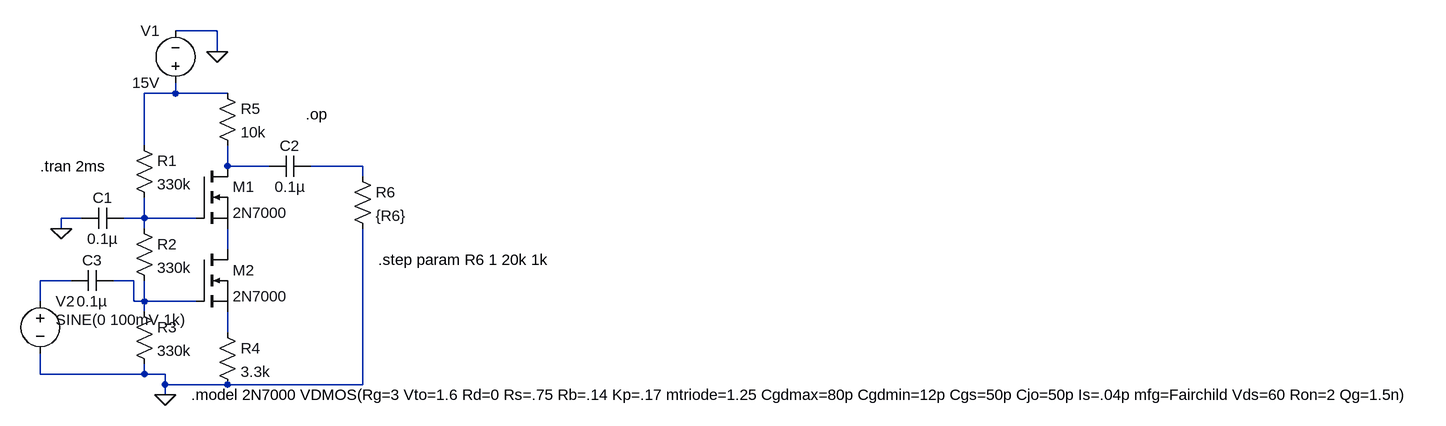
[diagram p0: schematic Draft2.asc]
Draft2.asc, the LTspice schematic file:
Version 4
SHEET 1 2268 680
WIRE 240 -208 176 -208
WIRE 240 -176 240 -208
WIRE 176 -112 176 -128
WIRE 176 -112 128 -112
WIRE 256 -112 176 -112
WIRE 128 -32 128 -112
WIRE 256 0 256 -32
WIRE 320 0 256 0
WIRE 464 0 384 0
WIRE 464 16 464 0
WIRE 32 80 0 80
WIRE 128 80 128 48
WIRE 128 80 96 80
WIRE 208 80 128 80
WIRE 0 96 0 80
WIRE 128 96 128 80
WIRE 256 128 256 96
WIRE 16 176 -32 176
WIRE 112 176 80 176
WIRE -32 208 -32 176
WIRE 112 208 112 176
WIRE 128 208 128 176
WIRE 128 208 112 208
WIRE 208 208 128 208
WIRE 128 224 128 208
WIRE 256 256 256 224
WIRE -32 320 -32 288
WIRE 128 320 128 304
WIRE 128 320 -32 320
WIRE 160 320 128 320
WIRE 160 336 160 320
WIRE 256 336 160 336
WIRE 464 336 464 96
WIRE 464 336 256 336
WIRE 160 352 160 336
FLAG 0 96 0
FLAG 240 -176 0
FLAG 160 352 0
SYMBOL cap 96 64 R90
WINDOW 0 0 32 VBottom 2
WINDOW 3 32 32 VTop 2
SYMATTR InstName C1
SYMATTR Value 0.1µ
SYMBOL res 112 -48 R0
SYMATTR InstName R1
SYMATTR Value 330k
SYMBOL res 112 80 R0
SYMATTR InstName R2
SYMATTR Value 330k
SYMBOL res 112 208 R0
SYMATTR InstName R3
SYMATTR Value 330k
SYMBOL nmos 208 0 R0
SYMATTR InstName M1
SYMATTR Value 2N7000
SYMBOL nmos 208 128 R0
SYMATTR InstName M2
SYMATTR Value 2N7000
SYMBOL res 240 240 R0
SYMATTR InstName R4
SYMATTR Value 3.3k
SYMBOL res 240 -128 R0
SYMATTR InstName R5
SYMATTR Value 10k
SYMBOL cap 384 -16 R90
WINDOW 0 0 32 VBottom 2
WINDOW 3 32 32 VTop 2
SYMATTR InstName C2
SYMATTR Value 0.1µ
SYMBOL cap 80 160 R90
WINDOW 0 0 32 VBottom 2
WINDOW 3 32 32 VTop 2
SYMATTR InstName C3
SYMATTR Value 0.1µ
SYMBOL voltage 176 -112 R180
WINDOW 0 24 96 Left 2
WINDOW 3 24 16 Left 2
WINDOW 123 0 0 Left 0
WINDOW 39 0 0 Left 0
SYMATTR InstName V1
SYMATTR Value 15V
SYMBOL voltage -32 192 R0
WINDOW 3 24 44 Left 2
WINDOW 123 0 0 Left 0
WINDOW 39 0 0 Left 0
SYMATTR InstName V2
SYMATTR Value SINE(0 100mV 1k)
SYMBOL res 448 0 R0
SYMATTR InstName R6
SYMATTR Value {R6}
TEXT 200 352 Left 2 !.model 2N7000 VDMOS(Rg=3 Vto=1.6 Rd=0 Rs=.75 Rb=.14 Kp=.17 mtriode=1.25 Cgdmax=80p Cgdmin=12p Cgs=50p Cjo=50p Is=.04p mfg=Fairchild Vds=60 Ron=2 Qg=1.5n)
TEXT -32 0 Left 2 !.tran 2ms
TEXT 376 -80 Left 2 !.op
TEXT 488 144 Left 2 !.step param R6 1 20k 1k

The netlist it stands for:
* Draft2.asc
C1 N004 0 0.1µ
R1 N001 N004 330k
R2 N004 N007 330k
R3 N007 0 330k
M1 N002 N004 N005 N005 2N7000
M2 N005 N007 N008 N008 2N7000
R4 N008 0 3.3k
R5 N001 N002 10k
C2 N003 N002 0.1µ
C3 N007 N006 0.1µ
V1 N001 0 15V
V2 N006 0 SINE(0 100mV 1k)
R6 N003 0 {R6}
.model NMOS NMOS
.model PMOS PMOS
.lib standard.mos
.model 2N7000 VDMOS(Rg=3 Vto=1.6 Rd=0 Rs=.75 Rb=.14 Kp=.17 mtriode=1.25 Cgdmax=80p Cgdmin=12p Cgs=50p Cjo=50p Is=.04p mfg=Fairchild Vds=60 Ron=2 Qg=1.5n)
.tran 2ms
.op
.step param R6 1 20k 1k
.backanno
.end